# Altium schematic sheet MCU.SchDoc
size A3; Author: ALP Electronics; CompanyName: ALP Electronics; DrawnBy: Caner Alp; Engineer: Caner Alp; Organization: ALP Electronics; Address2: Västerås; Address4: Sweden; SheetNumber: 7; SheetTotal: 14
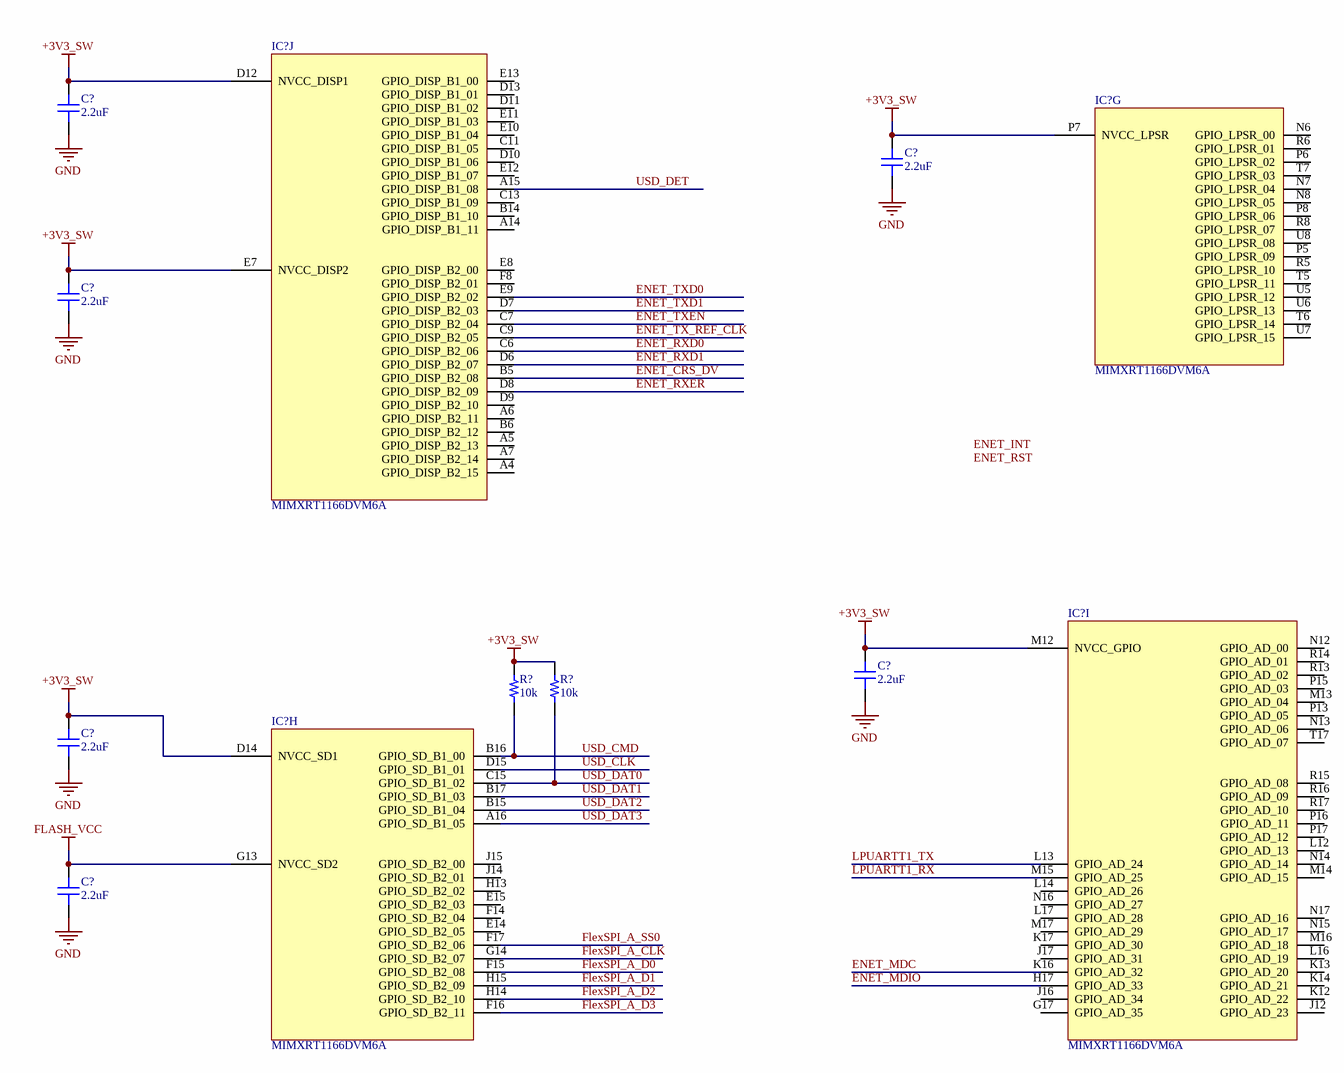
[diagram p0: MCU.SchDoc]

## Parts
(Parts that share a designator on the sheet are numbered #1, #2 ... from top to bottom, then left to right.)
C?#1  2.2uF  [CAP 0402/1005]
C?#2  2.2uF  [CAP 0402/1005]
C?#3  2.2uF  [CAP 0402/1005]
C?#4  2.2uF  [CAP 0402/1005]
C?#5  2.2uF  [CAP 0402/1005]
C?#6  2.2uF  [CAP 0402/1005]
IC?#1  MIMXRT1166DVM6A  [BGA289C80P17X17_1400X1400X152]  (part J of 12)
IC?#2  MIMXRT1166DVM6A  [BGA289C80P17X17_1400X1400X152]  (part G of 12)
IC?#3  MIMXRT1166DVM6A  [BGA289C80P17X17_1400X1400X152]  (part I of 12)
IC?#4  MIMXRT1166DVM6A  [BGA289C80P17X17_1400X1400X152]  (part H of 12)
R?#1  10k  [RES 0402/1005]
R?#2  10k  [RES 0402/1005]

## Nets
+3V3_SW: C?#1.2 C?#2.2 C?#3.2 C?#4.2 C?#5.2 IC?#1.D12(NVCC_DISP1) IC?#1.E7(NVCC_DISP2) IC?#2.P7(NVCC_LPSR) IC?#3.M12(NVCC_GPIO) IC?#4.D14(NVCC_SD1) R?#1.2 R?#2.2
FLASH_VCC: C?#6.2 IC?#4.G13(NVCC_SD2)
GND: C?#1.1 C?#2.1 C?#3.1 C?#4.1 C?#5.1 C?#6.1
ENET_CRS_DV: IC?#1.B5(GPIO_DISP_B2_08)
ENET_MDC: IC?#3.K16(GPIO_AD_32)
ENET_MDIO: IC?#3.H17(GPIO_AD_33)
ENET_RXD0: IC?#1.C6(GPIO_DISP_B2_06)
ENET_RXD1: IC?#1.D6(GPIO_DISP_B2_07)
ENET_RXER: IC?#1.D8(GPIO_DISP_B2_09)
ENET_TX_REF_CLK: IC?#1.C9(GPIO_DISP_B2_05)
ENET_TXD0: IC?#1.E9(GPIO_DISP_B2_02)
ENET_TXD1: IC?#1.D7(GPIO_DISP_B2_03)
ENET_TXEN: IC?#1.C7(GPIO_DISP_B2_04)
FlexSPI_A_CLK: IC?#4.G14(GPIO_SD_B2_07)
FlexSPI_A_D0: IC?#4.F15(GPIO_SD_B2_08)
FlexSPI_A_D1: IC?#4.H15(GPIO_SD_B2_09)
FlexSPI_A_D2: IC?#4.H14(GPIO_SD_B2_10)
FlexSPI_A_D3: IC?#4.F16(GPIO_SD_B2_11)
FlexSPI_A_SS0: IC?#4.F17(GPIO_SD_B2_06)
LPUARTT1_RX: IC?#3.M15(GPIO_AD_25)
LPUARTT1_TX: IC?#3.L13(GPIO_AD_24)
USD_CLK: IC?#4.D15(GPIO_SD_B1_01)
USD_CMD: IC?#4.B16(GPIO_SD_B1_00) R?#1.1
USD_DAT0: IC?#4.C15(GPIO_SD_B1_02) R?#2.1
USD_DAT1: IC?#4.B17(GPIO_SD_B1_03)
USD_DAT2: IC?#4.B15(GPIO_SD_B1_04)
USD_DAT3: IC?#4.A16(GPIO_SD_B1_05)
USD_DET: IC?#1.A15(GPIO_DISP_B1_08)

Not connected (* = marked no-connect by the designer): IC?#1 A4(GPIO_DISP_B2_15) A5(GPIO_DISP_B2_13) A6(GPIO_DISP_B2_11) A7(GPIO_DISP_B2_14) A14(GPIO_DISP_B1_11) B6(GPIO_DISP_B2_12) B14(GPIO_DISP_B1_10) C11(GPIO_DISP_B1_05) C13(GPIO_DISP_B1_09) D9(GPIO_DISP_B2_10) D10(GPIO_DISP_B1_06) D11(GPIO_DISP_B1_02) D13(GPIO_DISP_B1_01) E8(GPIO_DISP_B2_00) E10(GPIO_DISP_B1_04) E11(GPIO_DISP_B1_03) E12(GPIO_DISP_B1_07) E13(GPIO_DISP_B1_00) F8(GPIO_DISP_B2_01); IC?#2 N6(GPIO_LPSR_00) N7(GPIO_LPSR_04) N8(GPIO_LPSR_05) P5(GPIO_LPSR_09) P6(GPIO_LPSR_02) P8(GPIO_LPSR_06) R5(GPIO_LPSR_10) R6(GPIO_LPSR_01) R8(GPIO_LPSR_07) T5(GPIO_LPSR_11) T6(GPIO_LPSR_14) T7(GPIO_LPSR_03) U5(GPIO_LPSR_12) U6(GPIO_LPSR_13) U7(GPIO_LPSR_15) U8(GPIO_LPSR_08); IC?#3 G17(GPIO_AD_35) J12(GPIO_AD_23) J16(GPIO_AD_34) J17(GPIO_AD_31) K12(GPIO_AD_22) K13(GPIO_AD_20) K14(GPIO_AD_21) K17(GPIO_AD_30) L12(GPIO_AD_13) L14(GPIO_AD_26) L16(GPIO_AD_19) L17(GPIO_AD_28) M13(GPIO_AD_04) M14(GPIO_AD_15) M16(GPIO_AD_18) M17(GPIO_AD_29) N12(GPIO_AD_00) N13(GPIO_AD_06) N14(GPIO_AD_14) N15(GPIO_AD_17) N16(GPIO_AD_27) N17(GPIO_AD_16) P13(GPIO_AD_05) P15(GPIO_AD_03) P16(GPIO_AD_11) P17(GPIO_AD_12) R13(GPIO_AD_02) R14(GPIO_AD_01) R15(GPIO_AD_08) R16(GPIO_AD_09) R17(GPIO_AD_10) T17(GPIO_AD_07); IC?#4 E14(GPIO_SD_B2_05) E15(GPIO_SD_B2_03) F14(GPIO_SD_B2_04) H13(GPIO_SD_B2_02) J14(GPIO_SD_B2_01) J15(GPIO_SD_B2_00)

## Notes on the sheet
- Labels drawn without touching a wire or pin: ENET_INT, ENET_RST
- Title:
- Size:
- Project:
- A3
- Date:
- Revision:
- Drawn By:
- Sheet
- of

## Library data of the parts
C?#1-C?#6 = JMK105BJ225MV-F: CAP CER 2.2UF 6.3V X5R 0402; Manufacturer: Taiyo Yuden; TemperatureRange: -55C ~ 85C; Tolerance: 20%; Value: 2.2uF; Part Number: JMK105BJ225MV-F; PartId: 12339; Supplier 1: Digi-Key; Supplier Part Number 1: 587-1453-2-ND; ComponentLink1Description: Datasheet; ComponentLink1URL: http://ds.yuden.co.jp/TYCOMPAS/ut/detail.do?productNo=JMK105BJ225MV-F&fileName=JMK105BJ225MV-F_SS&mode=specSheetDownload; ComponentLink2Description: Digi-Key Listing; ComponentLink2URL: https://www.digikey.com/product-detail/en/taiyo-yuden/JMK105BJ225MV-F/587-1453-2-ND/1004041; TemperatureCoefficient: X5R; Voltage: 6.3V; Price: 0,028; Device Package: 0402 (1005 Metric)
IC?#1-IC?#4 = MIMXRT1166DVM6A: Integrated Circuit; Manufacturer_Name: NXP; Datasheet Link: https://www.mouser.in/datasheet/2/302/IMXRT1160CEC-2335852.pdf; Height: 1.52mm; Manufacturer_Part_Number: MIMXRT1166DVM6A; Mouser Part Number: 771-MIMXRT1166DVM6A; Mouser Price/Stock: https://www.mouser.co.uk/ProductDetail/NXP-Semiconductors/MIMXRT1166DVM6A?qs=DRkmTr78QARbPfoaiaD1vg%3D%3D
R?#1 R?#2 = RC0402JR-0710KL: RES SMD 10K OHM 5% 1/16W 0402; Manufacturer: Yageo; TemperatureRange: -55C ~ 155C; TemperatureCoefficient: 100ppm/C; PowerRating: 0.063W, 1/16W; Value: 10k; Part Number: RC0402JR-0710KL; PartId: 14464; Supplier 1: Digi-Key; Supplier Part Number 1: 311-10KJRTR-ND; ComponentLink1Description: Datasheet; ComponentLink1URL: http://www.yageo.com/documents/recent/PYu-RC_Group_51_RoHS_L_04.pdf; ComponentLink2Description: Digi-Key Listing; ComponentLink2URL: https://www.digikey.com/product-detail/en/yageo/RC0402JR-0710KL/311-10KJRTR-ND/726418; Tolerance: 5%; Price: 0,0017; Device Package: 0402 (1005 Metric)